# EAGLE schematic SRAMShield.sch (EAGLE 7.5.0)
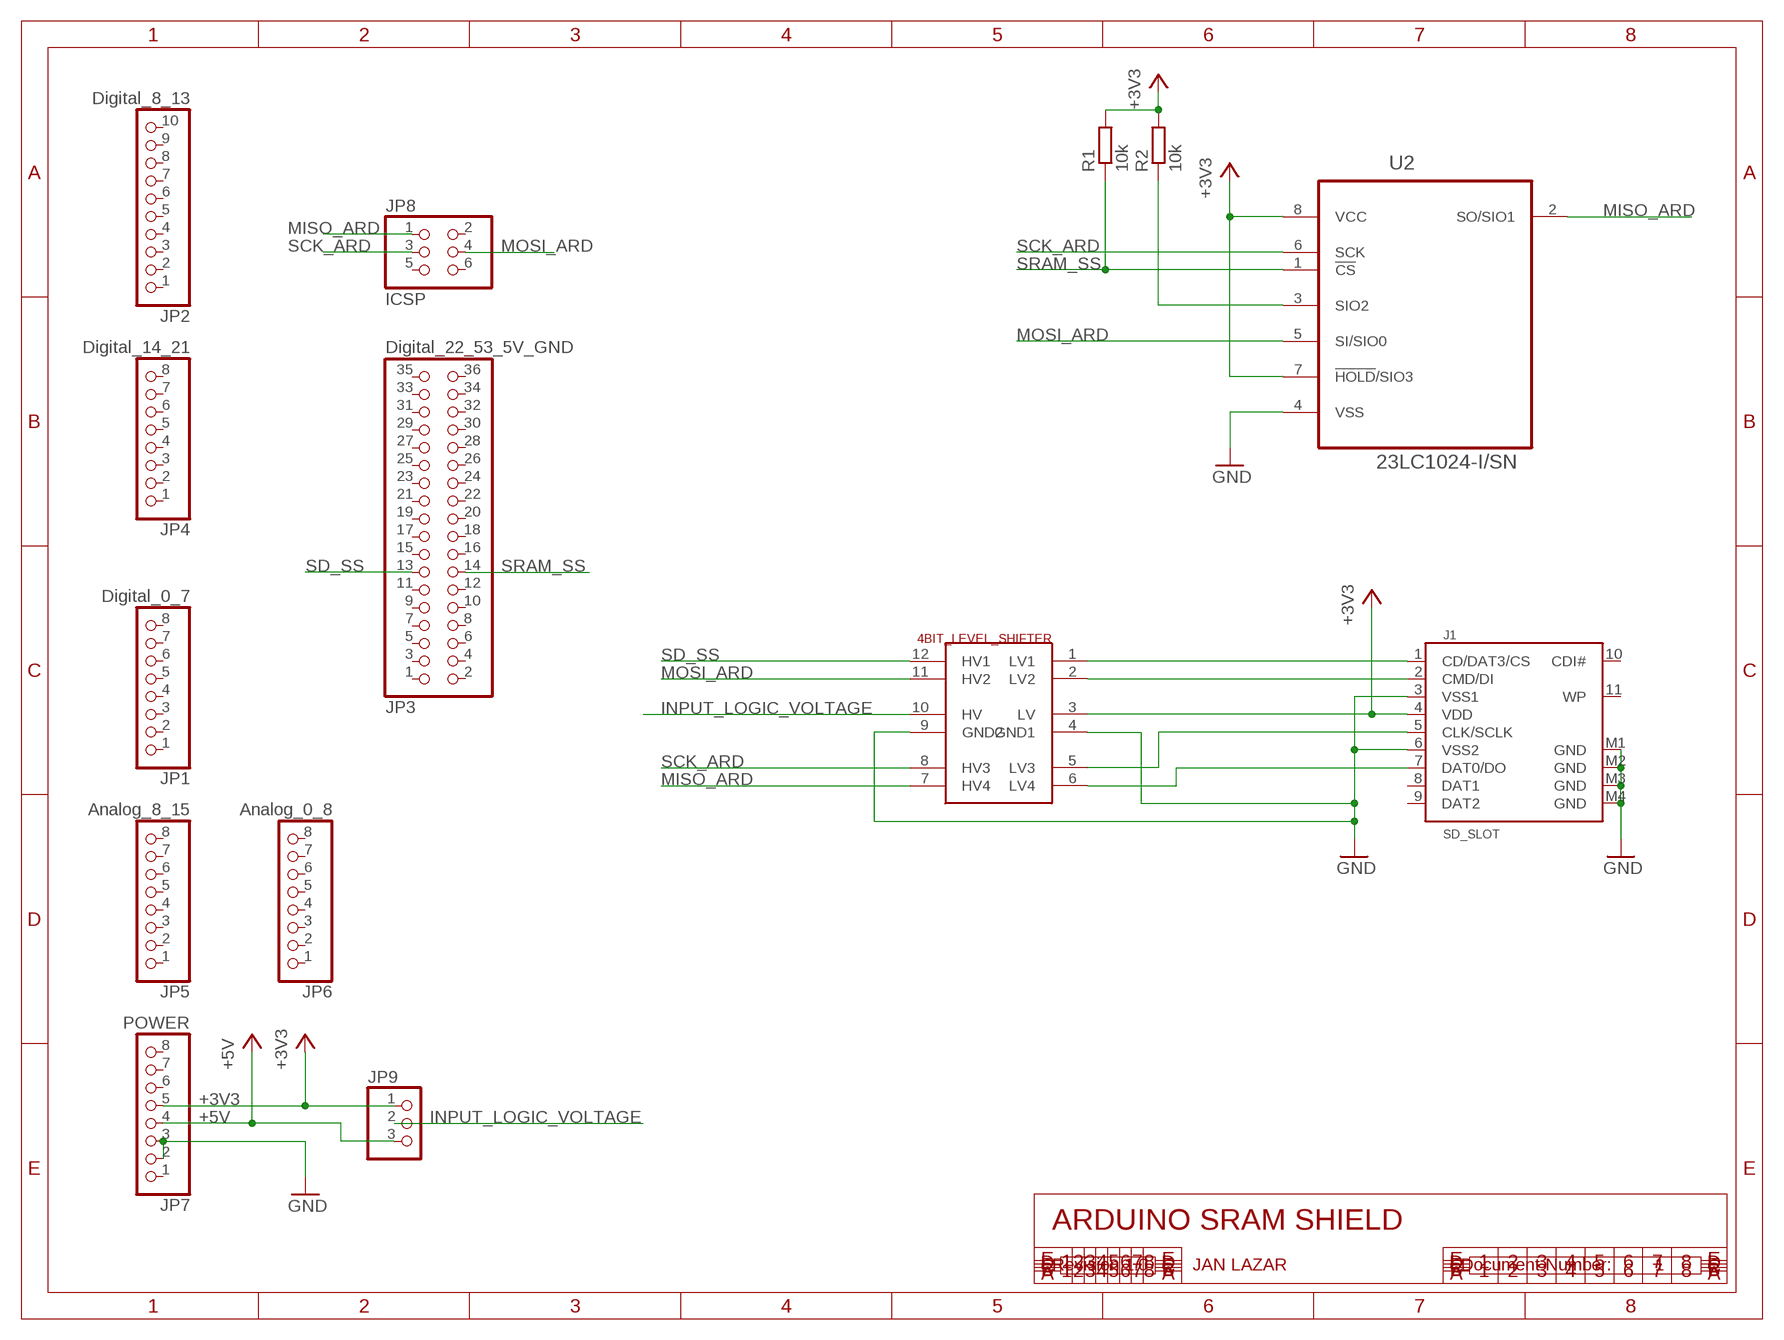
[diagram p0: schematic, sheet 1]

## Parts
4BIT_LEVEL_SHIFTER  4BIT_LEVEL_SHIFTER  [THT12]
J1  SD_SLOT  SDCARD  [SDCMF-10915W010]
JP1  Digital_0_7  PINHD-1X8  [1X08]
JP2  Digital_8_13  PINHD-1X10  [1X10]
JP3  Digital_22_53_5V_GND  PINHD-2X18  [2X18]
JP4  Digital_14_21  PINHD-1X8  [1X08]
JP5  Analog_8_15  PINHD-1X8  [1X08]
JP6  Analog_0_8  PINHD-1X8  [1X08]
JP7  POWER  PINHD-1X8  [1X08]
JP8  ICSP  PINHD-2X3  [2X03]
JP9  PINHD-1X3  [1X03]
R1  10k  R-EU_0204/7  [0204/7]
R2  10k  R-EU_0204/7  [0204/7]
U2  23LC1024-I/SN  [SOIC127P600X175-8N]

## Nets
+3V3: 4BIT_LEVEL_SHIFTER.3(LV) J1.4(VDD) JP7.5 JP9.1 R1.2 R2.2 U2.7(!HOLD!/SIO3) U2.8(VCC)
+5V: JP7.4 JP9.3
GND: 4BIT_LEVEL_SHIFTER.4(GND1) 4BIT_LEVEL_SHIFTER.9(GND2) J1.3(VSS1) J1.6(VSS2) J1.M1(GND) J1.M2(GND) J1.M3(GND) J1.M4(GND) JP7.2 JP7.3 U2.4(VSS)
INPUT_LOGIC_VOLTAGE: 4BIT_LEVEL_SHIFTER.10(HV) JP9.2
MISO_ARD: 4BIT_LEVEL_SHIFTER.7(HV4) JP8.1 U2.2(SO/SIO1)
MOSI_ARD: 4BIT_LEVEL_SHIFTER.11(HV2) JP8.4 U2.5(SI/SIO0)
N$2: 4BIT_LEVEL_SHIFTER.1(LV1) J1.1(CD/DAT3/CS)
N$4: 4BIT_LEVEL_SHIFTER.2(LV2) J1.2(CMD/DI)
N$5: 4BIT_LEVEL_SHIFTER.5(LV3) J1.5(CLK/SCLK)
N$6: 4BIT_LEVEL_SHIFTER.6(LV4) J1.7(DAT0/DO)
N$9: R2.1 U2.3(SIO2)
SCK_ARD: 4BIT_LEVEL_SHIFTER.8(HV3) JP8.3 U2.6(SCK)
SD_SS: 4BIT_LEVEL_SHIFTER.12(HV1) JP3.13
SRAM_SS: JP3.14 R1.1 U2.1(!CS)
Unconnected: J1.8(DAT1) J1.9(DAT2) J1.10(CDI#) J1.11(WP) JP1.1 JP1.2 JP1.3 JP1.4 JP1.5 JP1.6 JP1.7 JP1.8 JP2.1 JP2.2 JP2.3 JP2.4 JP2.5 JP2.6 JP2.7 JP2.8 JP2.9 JP2.10 JP3.1 JP3.2 JP3.3 JP3.4 JP3.5 JP3.6 JP3.7 JP3.8 JP3.9 JP3.10 JP3.11 JP3.12 JP3.15 JP3.16 JP3.17 JP3.18 JP3.19 JP3.20 JP3.21 JP3.22 JP3.23 JP3.24 JP3.25 JP3.26 JP3.27 JP3.28 JP3.29 JP3.30 JP3.31 JP3.32 JP3.33 JP3.34 JP3.35 JP3.36 JP4.1 JP4.2 JP4.3 JP4.4 JP4.5 JP4.6 JP4.7 JP4.8 JP5.1 JP5.2 JP5.3 JP5.4 JP5.5 JP5.6 JP5.7 JP5.8 JP6.1 JP6.2 JP6.3 JP6.4 JP6.5 JP6.6 JP6.7 JP6.8 JP7.1 JP7.6 JP7.7 JP7.8 JP8.2 JP8.5 JP8.6

## Notes on the sheet
- ARDUINO SRAM SHIELD
- Revision 1.0 | JAN LAZAR | Document Number: | 1

## Library data of the parts
4BIT_LEVEL_SHIFTER = levelShifter:4BIT_LEVEL_SHIFTER
J1 = sd-mmc:SDCARD: SD card connector KINGFONT SDCMF-10915W010
JP1 JP4-JP7 = pinhead:PINHD-1X8: PIN HEADER
JP2 = pinhead:PINHD-1X10: PIN HEADER
JP3 = pinhead:PINHD-2X18: PIN HEADER
JP8 = pinhead:PINHD-2X3: PIN HEADER
JP9 = pinhead:PINHD-1X3: PIN HEADER
R1 R2 = rcl:R-EU_: RESISTOR, European symbol
U2 = microchip_23LC1024:23LC1024-I/SN: 1Mbit SPI Serial SRAM,SOIC-8; MPN: 23LC1024-I/SN; OC_FARNELL: 2212150; OC_NEWARK: 94T8231; PACKAGE: SOIC-8; SUPPLIER: MICROCHIP